# EAGLE schematic Adafruit Metro ESP32-S3 (EAGLE 9.6.2)
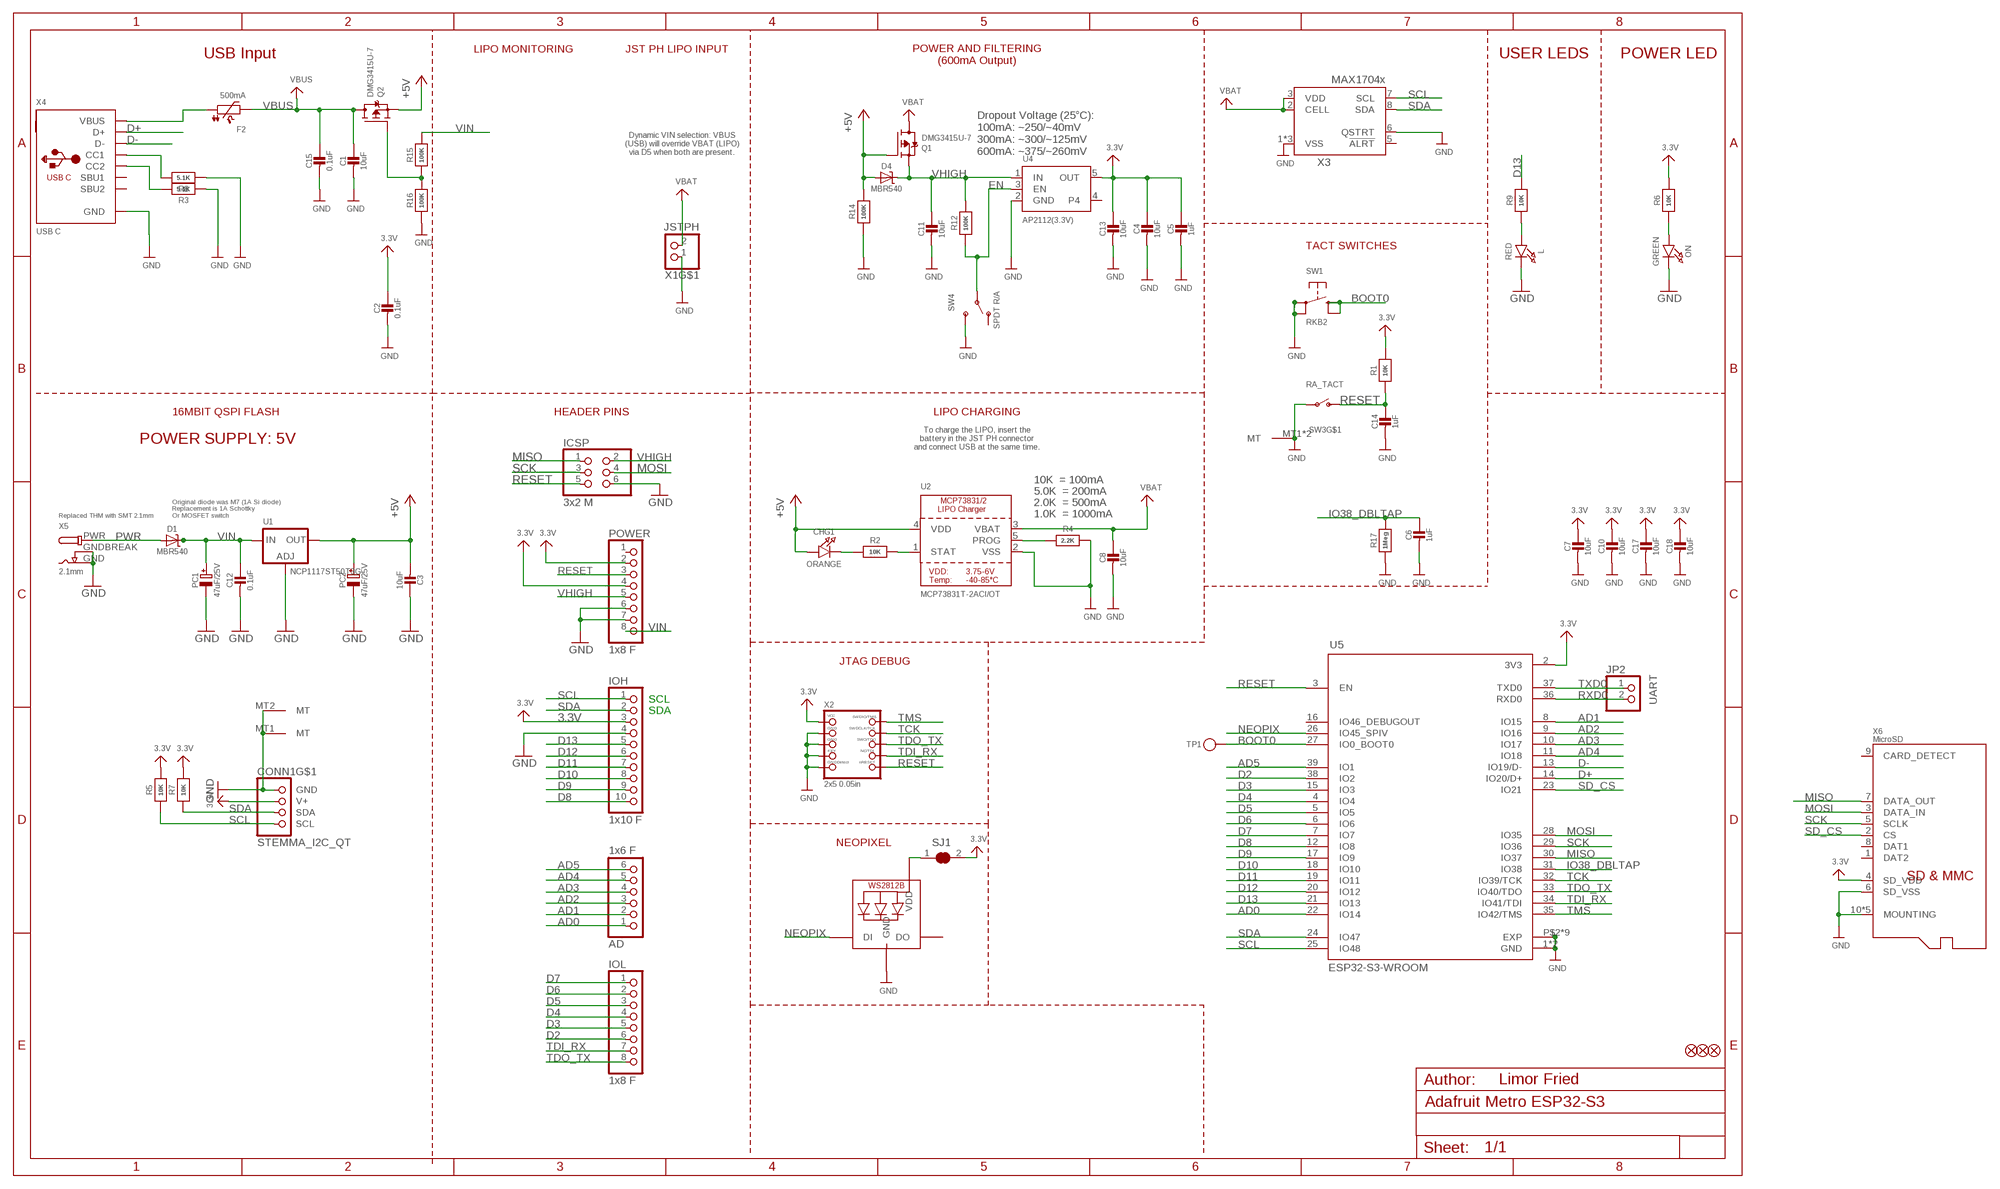
[diagram p0: schematic, sheet 1]

## Parts
AD  1x6 F  HEADER-1X6OVALWAVE  [1X06_OVALWAVE]
C1  10uF  CAP_CERAMIC0805-NOOUTLINE  [0805-NO]
C2  0.1uF  CAP_CERAMIC0603_NO  [0603-NO]
C3  10uF  CAP_CERAMIC0805-NOOUTLINE  [0805-NO]
C4  10uF  CAP_CERAMIC0805-NOOUTLINE  [0805-NO]
C5  1uF  CAP_CERAMIC0603_NO  [0603-NO]
C6  1uF  CAP_CERAMIC0603_NO  [0603-NO]
C7  10uF  CAP_CERAMIC0805-NOOUTLINE  [0805-NO]
C8  10uF  CAP_CERAMIC0805-NOOUTLINE  [0805-NO]
C10  10uF  CAP_CERAMIC0805-NOOUTLINE  [0805-NO]
C11  10uF  CAP_CERAMIC0805-NOOUTLINE  [0805-NO]
C12  0.1uF  CAP_CERAMIC0603_NO  [0603-NO]
C13  10uF  CAP_CERAMIC0805-NOOUTLINE  [0805-NO]
C14  1uF  CAP_CERAMIC0603_NO  [0603-NO]
C15  0.1uF  CAP_CERAMIC0603_NO  [0603-NO]
C17  10uF  CAP_CERAMIC0805-NOOUTLINE  [0805-NO]
C18  10uF  CAP_CERAMIC0805-NOOUTLINE  [0805-NO]
CHG1  ORANGE  LED0603_NOOUTLINE  [CHIPLED_0603_NOOUTLINE]
CONN1  STEMMA_I2C_QT  [JST_SH4]
D1  MBR540  DIODE-SCHOTTKYSOD-123  [SOD-123]
D4  MBR540  DIODE-SCHOTTKYSOD-123  [SOD-123]
F2  500mA  PTC_0805  [0805-NO]
FD1  FIDUCIAL_1MM  [FIDUCIAL_1MM]
FD2  FIDUCIAL_1MM  [FIDUCIAL_1MM]
FD3  FIDUCIAL_1MM  [FIDUCIAL_1MM]
ICSP  3x2 M  HEADER-2X3  [2X03_ROUND_70MIL]
IOH  1x10 F  HEADER-1X10OVALWAVE  [1X10_OVALWAVE]
IOL  1x8 F  HEADER-1X8OVALWAVE  [1X08_OVALWAVE]
JP2  UART  HEADER-1X2ROUND  [1X02_ROUND]
L  RED  LED0603_NOOUTLINE  [CHIPLED_0603_NOOUTLINE]
LED1  WS2812B_3535FULL  [LED3535_FULLPADS]
ON  GREEN  LED0603_NOOUTLINE  [CHIPLED_0603_NOOUTLINE]
PC1  47uF/25V  CAP_ELECTROLYTICPANASONIC_D  [PANASONIC_D]
PC2  47uF/25V  CAP_ELECTROLYTICPANASONIC_D  [PANASONIC_D]
POWER  1x8 F  HEADER-1X8OVALWAVE  [1X08_OVALWAVE]
Q1  DMG3415U-7  MOSFET-P  [SOT23-R]
Q2  DMG3415U-7  MOSFET-P  [SOT23-R]
R1  10K  RESISTOR_0603_NOOUT  [0603-NO]
R2  10K  RESISTOR_0603_NOOUT  [0603-NO]
R3  5.1K  RESISTOR_0603_NOOUT  [0603-NO]
R4  2.2K  RESISTOR_0603_NOOUT  [0603-NO]
R5  10K  RESISTOR_0603_NOOUT  [0603-NO]
R6  10K  RESISTOR_0603_NOOUT  [0603-NO]
R7  10K  RESISTOR_0603_NOOUT  [0603-NO]
R8  5.1K  RESISTOR_0603_NOOUT  [0603-NO]
R9  10K  RESISTOR_0603_NOOUT  [0603-NO]
R12  100K  RESISTOR_0603_NOOUT  [0603-NO]
R14  100K  RESISTOR_0603_NOOUT  [0603-NO]
R15  100K  RESISTOR_0603_NOOUT  [0603-NO]
R16  100K  RESISTOR_0603_NOOUT  [0603-NO]
R17  1Meg  RESISTOR_0603_NOOUT  [0603-NO]
SJ1  SOLDERJUMPER_CLOSED  [SOLDERJUMPER_CLOSEDWIRE]
SW1  RKB2  SWITCH_TACT_SMT_RKB2  [BTN_RKB2_4.6X2.8]
SW3  RA_TACT  SWITCH_SPST_MNT_TACT_RA  [SPST_TACTILE_RA]
SW4  SPDT R/A  SWITCH_SPDT  [SPDT_SMT_SSSS811101]
TP1  TESTPOINTROUND1.5MMNO  [TESTPOINT_ROUND_1.5MM_NO]
U1  NCP1117ST50T3G  LM1117SOT223-REFLOW  [SOT223-R]
U2  MCP73831T-2ACI/OT  MCP73831/2  [SOT23-5]
U4  AP2112(3.3V)  VREG_SOT23-5  [SOT23-5]
U5  ESP32-S3-WROOM  [S3-WROOM32]
X1  JSTPH  CON_JST_PH_2PIN_MT_BATT  [JSTPH2_BATT]
X2  2x5 0.05in  JTAG-CORTEXBOXPOSTS  [2X05_1.27MM_BOX_POSTS]
X3  MAX17048/T  [TDFN8_2X2MM]
X4  USB C  USB_C  [USB_C_CUSB31-CFM2AX-01-X]
X5  2.1mm  DCBARRELPTH  [DCJACK_2MM_PTH]
X6  MicroSD  MICROSD104031-0811  [MOLEX_104031-0811]

## Nets
3.3V [Power]: C2.1 C4.1 C5.1 C7.1 C10.1 C13.1 C17.1 C18.1 CONN1.2(V+) IOH.3 POWER.2 POWER.4 R1.2 R5.2 R6.2 R7.2 SJ1.2 U4.5(OUT) U5.2(3V3) X2.1(VCC) X6.4(SD_VDD)
+5V [Power]: C3.2 CHG1.A D4.A PC2.+ Q1.1(G) Q2.2(S) R14.2 U1.2(OUT) U1.4(OUT) U2.4(VDD)
AD0: AD.1 U5.22(IO14)
AD1: AD.2 U5.8(IO15)
AD2: AD.3 U5.9(IO16)
AD3: AD.4 U5.10(IO17)
AD4: AD.5 U5.11(IO18)
AD5: AD.6 U5.39(IO1)
BOOT0: SW1.B'(S1) SW1.B(S) TP1.P$1 U5.27(IO0_BOOT0)
D2: IOL.6 U5.38(IO2)
D3: IOL.5 U5.15(IO3)
D4: IOL.4 U5.4(IO4)
D5: IOL.3 U5.5(IO5)
D6: IOL.2 U5.6(IO6)
D7: IOL.1 U5.7(IO7)
D8: IOH.10 U5.12(IO8)
D9: IOH.9 U5.17(IO9)
D10: IOH.8 U5.18(IO10)
D11: IOH.7 U5.19(IO11)
D12: IOH.6 U5.20(IO12)
D13: IOH.5 R9.2 U5.21(IO13)
D+: U5.14(IO20/D+) X4.A6(D+) X4.B6(D+)
D-: U5.13(IO19/D-) X4.A7(D-) X4.B7(D-)
EN: R12.1 SW4.B(P) U4.3(EN)
GND [lowpower]: C1.2 C2.2 C3.1 C4.2 C5.2 C6.2 C7.2 C8.2 C10.2 C11.2 C12.2 C13.2 C14.2 C15.2 C17.2 C18.2 CONN1.1(GND) CONN1.MT1(MT) CONN1.MT2(MT) ICSP.6 IOH.4 L.C LED1.4(GND) ON.C PC1.- PC2.- POWER.6 POWER.7 R3.1 R4.2 R8.1 R14.1 R16.1 R17.1 SW1.A'(P1) SW1.A(P) SW3.1(P) SW3.MT1(MT) SW3.MT2(MT) SW4.C(S) U1.1(ADJ) U2.2(VSS) U4.2(GND) U5.1(GND) U5.40(GND) U5.P$2(EXP) U5.P$3(EXP) U5.P$4(EXP) U5.P$5(EXP) U5.P$6(EXP) U5.P$7(EXP) U5.P$8(EXP) U5.P$9(EXP) U5.P$10(EXP) X1.1 X2.3(GND) X2.5(GND) X2.7(KEY) X2.9(GNDDETECT) X3.1(VSS) X3.4(VSS) X3.6(QSTRT) X3.THERMAL(VSS) X4.A1B12(GND) X4.B1A12(GND) X5.GND X5.GNDBREAK X6.6(SD_VSS) X6.10(MOUNTING) X6.G1(MOUNTING) X6.G2(MOUNTING) X6.G3(MOUNTING) X6.G4(MOUNTING)
IO38_DBLTAP: C6.1 R17.2 U5.31(IO38)
MISO: ICSP.1 U5.30(IO37) X6.7(DATA_OUT)
MOSI: ICSP.4 U5.28(IO35) X6.3(DATA_IN)
N$1: L.A R9.1
N$2: Q2.1(G) R15.1 R16.2
N$3: ON.A R6.1
N$4: CHG1.C R2.1
N$5 [Power]: LED1.2(VDD) SJ1.1
N$6: R2.2 U2.1(STAT)
N$7: R8.2 X4.A5(CC1)
N$8: R3.2 X4.B5(CC2)
N$9: R4.1 U2.5(PROG)
N$13: F2.1 X4.A4B9(VBUS) X4.B4A9(VBUS)
NEOPIX: LED1.1(DI) U5.26(IO45_SPIV)
PWR: D1.A X5.PWR
RESET: C14.1 ICSP.5 POWER.3 R1.1 SW3.2(S) U5.3(EN) X2.10(NRESET)
RXD0: JP2.2 U5.36(RXD0)
SCK: ICSP.3 U5.29(IO36) X6.5(SCLK)
SCL: CONN1.4(SCL) IOH.1 R5.1 U5.25(IO48) X3.7(SCL)
SD_CS: U5.23(IO21) X6.2(CS)
SDA: CONN1.3(SDA) IOH.2 R7.1 U5.24(IO47) X3.8(SDA)
TCK: U5.32(IO39/TCK) X2.4(SWDCLK)
TDI_RX: IOL.7 U5.34(IO41/TDI) X2.8(TDI)
TDO_TX: IOL.8 U5.33(IO40/TDO) X2.6(SWO)
TMS: U5.35(IO42/TMS) X2.2(SWDIO)
TXD0: JP2.1 U5.37(TXD0)
VBAT [Power]: C8.1 Q1.3(D) U2.3(VBAT) X1.2 X3.2(CELL) X3.3(VDD)
VBUS: C1.1 C15.1 F2.2 Q2.3(D)
VHIGH [Power]: C11.1 D4.C ICSP.2 POWER.5 Q1.2(S) R12.2 U4.1(IN)
VIN [USB]: C12.1 D1.C PC1.+ POWER.8 R15.2 U1.3(IN)
Unconnected: LED1.3(DO) POWER.1 SW4.A(O) U4.4 U5.16(IO46_DEBUGOUT) X1.NC1 X1.NC2 X3.5(!ALRT) X4.A8(SBU1) X4.B8(SBU2) X6.1(DAT2) X6.8(DAT1) X6.9(CARD_DETECT)

## Notes on the sheet
- USB Input | LIPO MONITORING | JST PH LIPO INPUT | USER LEDS | POWER LED
- POWER AND FILTERING
  (600mA Output)
- Dynamic VIN selection: VBUS
  (USB) will override VBAT (LIPO)
  via D5 when both are present.
- Dropout Voltage (25°C):
  100mA: ~250/~40mV
  300mA: ~300/~125mV
  600mA: ~375/~260mV
- TACT SWITCHES
- 16MBIT QSPI FLASH | HEADER PINS | LIPO CHARGING
- POWER SUPPLY: 5V
- To charge the LIPO, insert the
  battery in the JST PH connector
  and connect USB at the same time.
- 10K  = 100mA
- 5.0K  = 200mA
- 2.0K  = 500mA
- Replaced THM with SMT 2.1mm
- Original diode was M7 (1A Si diode)
  Replacement is 1A Schottky
  Or MOSFET switch
- 1.0K  = 1000mA
- JTAG DEBUG
- SCL
- SDA
- NEOPIXEL
- Limor Fried

## Library data of the parts
AD = microbuilder:HEADER-1X6: PIN HEADER
C1-C8 C10-C15 C17 C18 = microbuilder:CAP_CERAMIC: Ceramic Capacitors For new designs, use the packages preceded by an '_' character since they are more reliable: The following footprints should be used on most boards: _0402 - Standard footprint for regular board layouts _0603 - Standard footprint for regular board layouts _0805 - Standard footprint for regular board layouts _1206 - Standard footprint for regular board layouts For extremely tight-pitch boards where space is at a premium, the following 'micro-pitch' footprints can be used (smaller pads, no silkscreen outline, etc.): _0402MP - Micro-pitch footprint for very dense/compact boards _0603MP - Micro-pitch footprint for very dense/compact boards _0805MP - Micro-pitch footprint for very dense/compact boards _1206MP - Micro-pitch footprint for very dense/compact boards
CHG1 L ON = microbuilder:LED: LED 0603 - 0603 Surface Mount Package 2mA: Green LED - Low Power (3.9mcd, 2ma, 1.7Vf) - Digikey: 475-2709-2-ND Orange LED - Low Power (9.8mcd, 2ma, 1.8Vf) - Digikey: 475-1194-2-ND Red LED - Low Power (5mcd, 2ma, 1.8Vf) - Digikey: 475-1195-2-ND Yellow LED - Low Power (7mcd, 2ma, 1.8Vf) - Digikey: 475-1196-2-ND 5mA: Blue LED - Low Power (17mcd, 5ma, 2.9Vf) - Digikey: LNJ937W8CRACT-ND 0805 - 0805 Surface Mount Package 2mA: Red LED (8.8mcd, 2mA, 1.8Vf, Clear) - Low Power [Digikey: 475-2510-1-ND] Green LED (5mcd, 2mA, 1.8Vf, Clear) - Low Power [Digikey: 475-2730-1-ND] Yellow LED (11.3mcd, 2mA, 1.8Vf, Clear) - Low Power [Digikey: 475-2555-1-ND] 20mA: Red LED (104mcd, 20mA, Diffused) - LS R976 [Digikey: 475-1278-6-ND] Red LED (12mcd, 20mA, 2.0Vf, Clear) - APT2012EC [Digikey: 754-1128-1-ND] Green LED (15mcd, 20mA, 2.2Vf, Clear) - APT2012GC [Digikey: 754-1131-1-ND] Orange LED (160mcd, 20mA, 2.1Vf, Clear) - APT2012SECK [Digikey: 754-1130-1-ND] 1206 - 1206 Surface Mount Package Green LED (26mcd, 20mA, Diffused) - LG N971 [Digikey: 475-1407-6-ND] Red LED (15mcd, 20mA, Diffused) - LH N974 [Digikey: 475-1416-6-ND] Cree - Cree High-Power Surface Mount LEDs XPEBWT-L1-0000-00D50 - White 111lm 350mA 2.9Vf 6200K 110° XTEAWT-00-0000-00000LEE3 - White 114lm 350mA 2.85Vf 5000K 115° Everlight - Everlight 45-21 Series Surface Mount LEDs 45-21/QK2C-B2832AC2CB2/2T - Warm White 2000mcd 20mA 3.25Vf 3050K 120° 45-21/LK2C-B38452C4CB2/2T - Nuetral White 2000mcd 20mA 3.25Vf 4150K 120° 45-21/LK2C-B50634C6CB2/2T - Cold White 2200mcd 20mA 3.25Vf 5650K 120° PLCC2 Reverse Mount LS T77K-J1L2-1-0-2-R18-Z - Red 11.25mcd 2mA 1.8Vf 630nm 120° LO T77K-L1M2-24-Z - Orange 19.6mcd 2mA 1.8Vf 606nm 120° LY T77K-K2M1-26-Z - Yellow 15.7mcd 2mA 1.8Vf 587nm 120°; ROT: 270
CONN1 = adafruit_electromech:STEMMA_I2C; LCSC: C2845363
D1 D4 = microbuilder:DIODE-SCHOTTKY
F2 = microbuilder:PTC: PTC (Resettable Fuse) 1206 Package 250mA PTC (16V Max, Time-to-Trip: 0.08s) - Digikey: F2110CT-ND 1210 Package 100mA PTC (30V Max, Time-to-Trip: 0.6s) - Digikey: MF-USMF010-2CT-ND 1812 Package 750mA PTC (24V Max, Time-to-Trip: 0.2s) - Digikey: MF-MSMF075/24-2CT-ND
FD1-FD3 = microbuilder:FIDUCIAL: Fiducial Alignment Points Various fiducial points for machine vision alignment.; BOM: EXCLUDE
ICSP = microbuilder:HEADER-2X3: PIN HEADER
IOH = microbuilder:HEADER-1X10: PIN HEADER
IOL POWER = microbuilder:HEADER-1X8: PIN HEADER
JP2 = microbuilder:HEADER-1X2: PIN HEADER
LED1 = microbuilder:WS2812B
PC1 PC2 = microbuilder:CAP_ELECTROLYTIC: Electrolytic Capacitors SMT PANASONIC_C - Size C Panasonic Electrolytic Aluminum Capacitor 47µF 16V 20% Electrolytic Capacitor [Digikey: PCE3890TR-ND] PANASONIC_D - Size D Panasonic Electrolytic Aluminum Capacitor 100µF 25V 20% Electrolytic Capacitor [Digikey: PCE3898TR-ND] PTH 3.5 mm grid, 8 mm diameter ... 3.5 mm grid, 10 mm diameter ...
Q1 Q2 = microbuilder:MOSFET-P: P-Channel Mosfet LEGEND VDS: Voltage Drain-Source ID: Drain Current RDS(ON): Drain-Source On-State Resistance VGS(TH): Gate-Source Threshold Voltage CISS: Drain-Source Input Capacitance SOT-23 Name VDS ID RDS(ON) VGS(TH) CISS Order Number IRLML5103 30V 760mA 600 mOhm -- 75pF @ 25V Digikey: IRLML5103PBFCT-ND IRLML6401 12V 4.3A 50 mOhm 950mV @ 250µA 830pF @ 10V Digikey: IRLML6401PBFTR-ND NTR0202PL 20V 400mA 800 mOhm 2.3V @ 250uA 70pF @ 5V Digikey: NTR0202PLT1GOSTR-ND NTR4101PT1G 20V 1.8A 85 mOhm 1.2V @ 250uA 675pF @ 10V Digikey: NTR4101PT1GOSCT-ND DMP2004K 20V 600mA 900 mOhm 1V @ 250uA 175pF @ 16V Digikey: DMP2004KDICT-ND PMV65XP 20V 3.9A 76 mOhm 950mV @ 1mA 725pF @ 20V Digikey: 568-2358-2-ND TO-252 Name VDS ID RDS(ON) VGS(TH) CISS Order Number AOD417 30V 25A 34 mOhm 3V @ 250µA 920pF @ 15V Digikey: 785-1106-2-ND PowerPak Name VDS ID RDS(ON) VGS(TH) CISS Order Number AON7401 30V 12A 14 mOhm 3V @ 250µA 2600pF @ 15V Digikey: 785-1302-1-ND
R1-R9 R12 R14-R17 = microbuilder:RESISTOR: Resistors For new designs, use the packages preceded by an '_' character since they are more reliable: The following footprints should be used on most boards: _0402 - Standard footprint for regular board layouts _0603 - Standard footprint for regular board layouts _0805 - Standard footprint for regular board layouts _1206 - Standard footprint for regular board layouts For extremely tight-pitch boards where space is at a premium, the following 'micro-pitch' footprints can be used (smaller pads, no silkscreen outline, etc.): _0402MP - Micro-pitch footprint for very dense/compact boards _0603MP - Micro-pitch footprint for very dense/compact boards _0805MP - Micro-pitch footprint for very dense/compact boards _1206MP - Micro-pitch footprint for very dense/compact boards
SJ1 = microbuilder:SOLDERJUMPER_CLOSED: Solder Jumper - Closed These solder jumpers are closed by default CLOSEDWIRE - 10 mil trace between pads that can be cut and resoldered later CLOSEDPERM - 63 mil trace between pads for a permanent connection (used to 'bridge' two signals, a shameless hack for Eagle). Can double as a test point as well (no cream layer)
SW1 = adafruit_electromech:SWITCH_TACT_SMT: SMT Tact Switches RKB2 https://www.digikey.com/short/m027prz5
SW3 = adafruit_electromech:SWITCH_SPST_MNT: Switch - SPST 4UCon 19192 (6.7x2.6mm SMT); LCSC: C778159
SW4 = adafruit_electromech:SWITCH_SPDT: Switch - SPDT SSSS811101 - Horizontal Two Position SMT, 0.3A 4V [Mouser: 688-SSSS811101]
TP1 = microbuilder:TESTPOINT: Test Point Various test points for characterisation and PCB testing TESTPOINT_SMT - Compact Surface Mount Test Point [Digikey: 5016KTR-ND]
U1 = microbuilder:LM1117: LM1117 Voltage Regulator LM1117 Adjustable Voltage regulator [Digikey: LM1117IMP-ADJDKR-ND] LM1117 3.3V Voltage regulator [AP1117E33GDIDKR-ND] LM1117 5.0V Voltage regulator [AP1117E50GDIDKR-ND] SOT223-REFLOW - SOT223 package for solder paste/reflow ovens SOT223-WAVE - SOT223 package for hand-soldering (larger pads) Note: For the fixed-voltage regulators, simply set the ADJ pin to GND.
U2 = microbuilder:MCP73831/2: MCP73831/2 LIPO Charger VDD: 3.75 - 6V Temp -40 - 85°C Programmable Charge Rate: 15-500mA NOTE: STAT is a tri-state logic output on the MCP73831 and an open-drain output on the MCP73832. SOT23-5 with 4.2V output and tri-state logic on STAT = MCP73831T-2ACI/OT; JLC_ROTATION: 0; LCSC: C424093
U4 = adafruit_power:VREG_SOT23-5: SOT23-5 Fixed Voltage Regulators Part Current Out V Out V In V Dropout θJA (°C/W) TJ (°C) Digikey Part No. ADP121 150mA 3.3V 3.4-5.5V 0.09V @ 150mA -- -- ADP121-AUJZ33R7CT-ND ADP121 150mA 3.0V 3.1-5.5V 0.09V @ 150mA -- -- ADP121-AUJZ30R7CT-ND ADP122 300mA 3.3V 3.4-5.5V 0.085V @ 300mA -- -- ADP122AUJZ-3.3-R7CT-ND ADP1712 300mA 3.3V 3.5-5.5V 0.17V @ 300mA -- -- ADP1712AUJZ-3.3-R7TR-ND AP7311 (Low Cost) 150mA 3.3V 3.5-6V 0.15V @ 150mA -- -- AP7311-33WG-7DICT-ND LD39015M18R 150mA 1.8V 1.9V-5.5V 0.08V @ 100mA -- -- 497-6977-1-ND LP2985A-33DBVR 150mA 3.3V 3.3-16V 0.28V @ 150mA 206 150 296-18479-1-ND MCP1824T-3302E/OT 300mA 3.3V 3.5V-6V 0.2V @ 300mA -- -- MCP1824T-3302E/OTCT-ND MIC5205-2.5YM5 TR 150mA 2.5V 2.7-16V 0.165V @ 150mA -- -- 576-1257-2-ND MIC5205-3.0YM5 TR 150mA 3.0V 3.2V-16V 0.165V @ 150mA -- -- 576-1258-2-ND MIC5205-3.3YM5 TR 150mA 3.3V 3.5V-16V 0.165V @ 150mA -- -- 576-1259-2-ND TPS780330220 150mA 3.3V+2.2V 3.6-5.5V 250mV Max -- -- 296-23332-1-ND TDA3663/N1,135 100mA 3.3V 3.5-45V 0.18V @ 50mA -- -- 568-5343-1-ND Max operating temp can be calculated using θJA, TJ (max junction temperature), and power in watts. Set the "Maximum Ambient Temperature" until it reaches TJ ("Max Junction Temperature"), which is the absolute limit for safe use of the regulator: Heat Sink Temperature Calculator <http://www.daycounter.com/Calculators/Heat-Sink-Temperature-Calculator.phtml> For example, With 12V source into a 3.3V LP2985 and a 30mA load, we are dissipating (12V-3.3V) * 0.03A = 0.261W. With a θJA of 206 °C/W, a TJ of 150°C, and 261mW we can safely use the chip without a heat sink up to 75°C (=147.1°C Junction Temperature).; JLC_ROTATION: 0
U5 = adafruit_wireless:ESP32-S3-WROOM: WiFi 802.11b/g/n Transceiver Module 2.4GHz Antenna Not Included Surface Mount Check prices <https://snapeda.com/parts/ESP32-S2-WROVER/Espressif%20Systems/view-part/?ref=eda>
X1 = adafruit_electromech:CON_JST_PH_2PIN_MT; LCSC: C47647
X2 = adafruit_electromech:JTAG-CORTEX: Serial Wire (SW-DP) Connector Standard 0.05" 10-pin connector is for use with the Cortex M and Cortex A SWD (serial wire debugger) interface (SW-DP) Connectors 2x05_1.27MM_SMT - Inexpensive surface-mount header with bare pins, compatible with standard 10-pin SWD cables (4UCON: 16846) 2x05_1.27MM_BOX_NOPOSTS - Polarised surface-mount box (4UCON with caps: 19735, without caps: 15117 2x05_1.27MM_BOX_POSTS - Polarised surface-mount box with mounting holes (4UCON: 20317) Pinout: http://infocenter.arm.com/help/topic/com.arm.doc.faqs/attached/13634/cortex_debug_connectors.pdf http://www.keil.com/peripherals/coresight/connectors.asp
X3 = adafruit_sensor:MAX17048; ROT: 270
X4 = adafruit_electromech:USB_C: USB Type-C USB 2.0 Connector; LCSC: C165948
X5 = adafruit_electromech:DCBARREL: DC Barrel Jack DCJACK_1.3MM_PTH - Through Hole 1.3mm Jack (4UConnector: 05536) DCJACK_2MM_PTH - Through Hole 2.0/2.1 Jack (4UConnector: 05537) DCJACK_2MM_SMT - SMT 2.0/2.1mm Jack(4UConnector: 03267)
X6 = adafruit_electromech:MICROSD: MicroSD/Transflash Card Holder with SPI pinout 3M: 2908-05WB-MG 4UConnector: 19656 Footprint courtesy: Adafruit Industries

## Net classes
2 lowpower: width 0.305 mm, drill 0.483 mm
3 Power: width 0.305 mm, drill 0.483 mm